# EAGLE schematic cbm2ram (EAGLE 7.7.0)
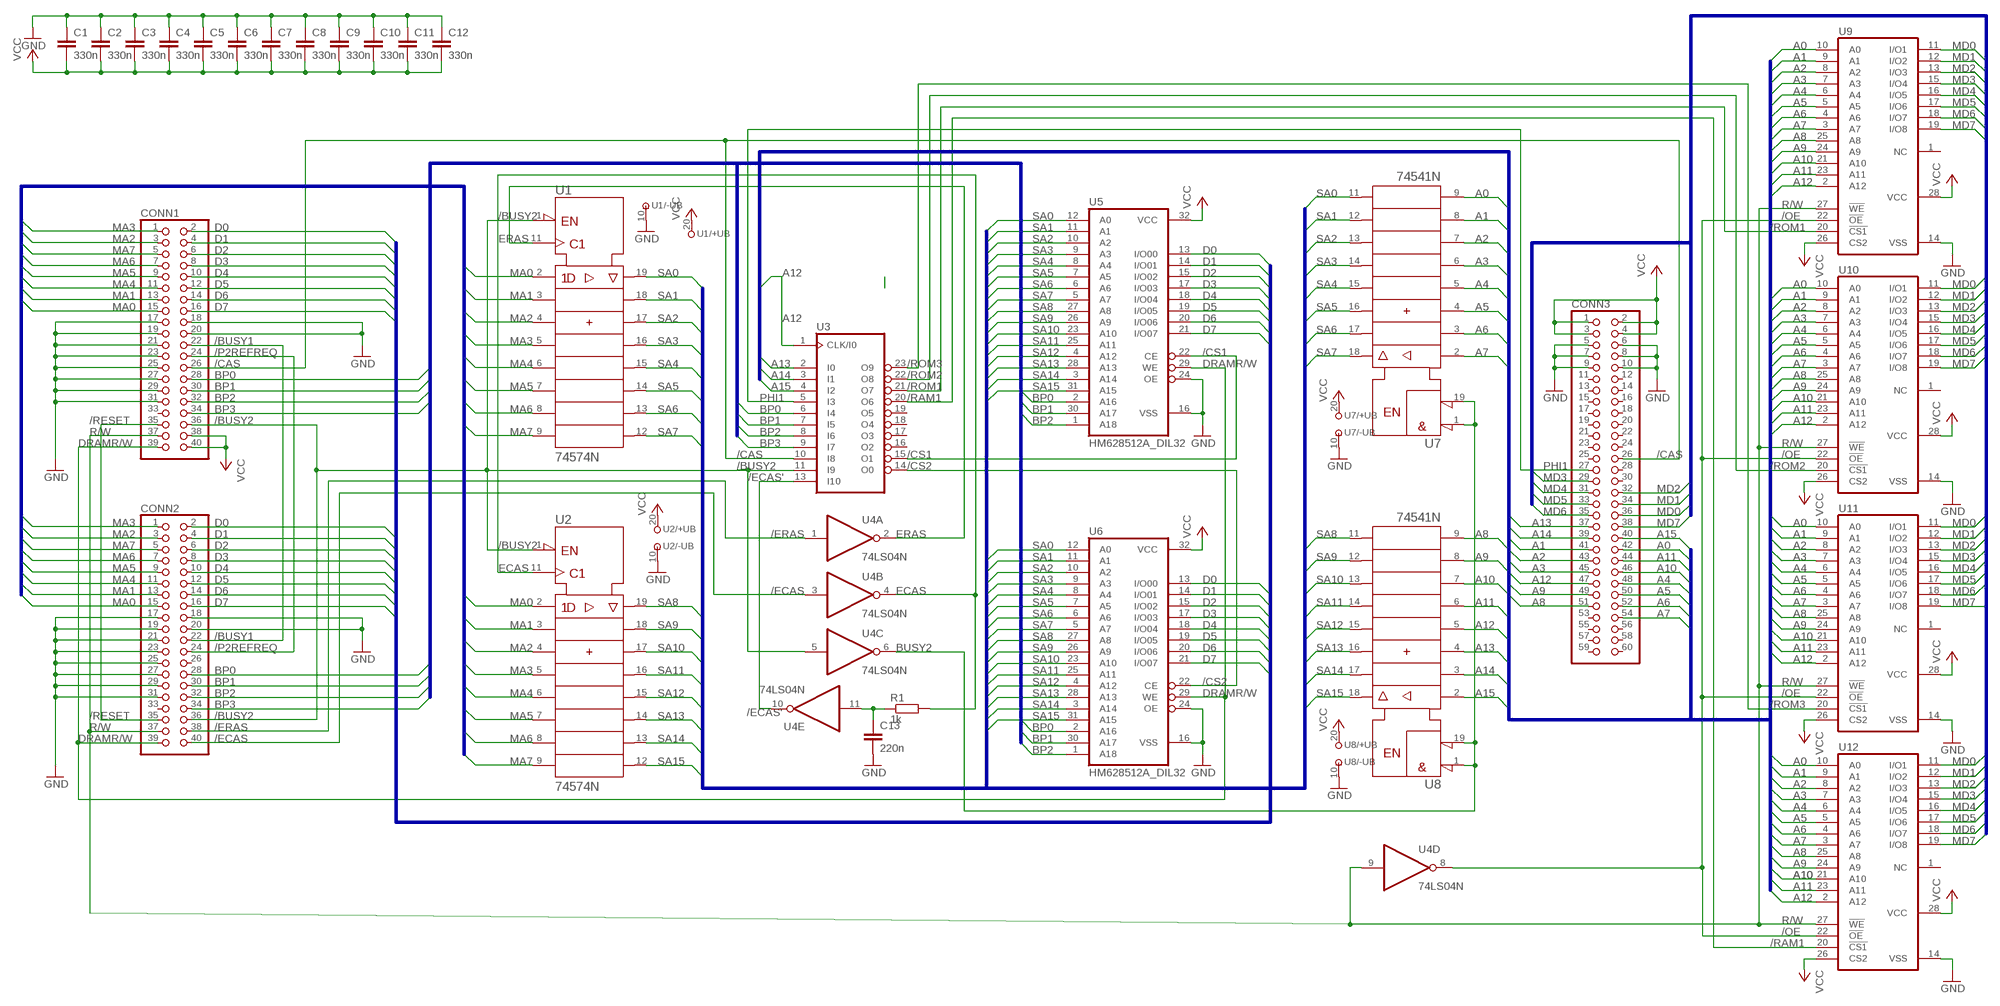
[diagram p0: schematic, sheet 1]

## Parts
C1  330n  C5/3  [C5B3]
C2  330n  C5/3  [C5B3]
C3  330n  C5/3  [C5B3]
C4  330n  C5/3  [C5B3]
C5  330n  C5/3  [C5B3]
C6  330n  C5/3  [C5B3]
C7  330n  C5/3  [C5B3]
C8  330n  C5/3  [C5B3]
C9  330n  C5/3  [C5B3]
C10  330n  C5/3  [C5B3]
C11  330n  C5/3  [C5B3]
C12  330n  C5/3  [C5B3]
C13  220n  C5/3  [C5B3]
CONN1  PINHD-2X20  [2X20]
CONN2  PINHD-2X20  [2X20]
CONN3  PINHD-2X30  [2X30]
R1  1k  R-EU_0207/10  [0207/10]
U1  74574N  [DIL20]
U2  74574N  [DIL20]
U3  22V10  [DIL24-3]
U4  74LS04N  [DIL14]
U5  HM628512A_DIL32  [DIL32]
U6  HM628512A_DIL32  [DIL32]
U7  74541N  [DIL20]
U8  74541N  [DIL20]
U9  6264A  [DIL28-6]
U10  6264A  [DIL28-6]
U11  6264A  [DIL28-6]
U12  6264A  [DIL28-6]

## Nets
/BUSY1: CONN1.22 CONN2.22
/BUSY2: CONN1.36 CONN2.36 U1.1(!OC) U2.1(!OC) U3.11(I9) U4.5(C:I)
/CAS: CONN1.26 CONN3.26 U3.10(I8)
/CS1: U3.15(O1) U5.22(CE)
/CS2: U3.14(O0) U6.22(CE)
/ECAS: CONN2.40 U4.3(B:I)
/ECAS': U3.13(I10) U4.10(E:O)
/ERAS: CONN2.38 U4.1(A:I)
/OE: U4.8(D:O) U9.22(!OE) U10.22(!OE) U11.22(!OE) U12.22(!OE)
/P2REFREQ: CONN1.24 CONN2.24
/RAM1: U3.20(O6) U12.20(!CS1)
/RESET: CONN1.35 CONN2.35
/ROM1: U3.21(O7) U9.20(!CS1)
/ROM2: U3.22(O8) U10.20(!CS1)
/ROM3: U3.23(O9) U11.20(!CS1)
A0: CONN3.42 U7.9(A8) U9.10(A0) U10.10(A0) U11.10(A0) U12.10(A0)
A1: CONN3.41 U7.8(A7) U9.9(A1) U10.9(A1) U11.9(A1) U12.9(A1)
A2: CONN3.43 U7.7(A6) U9.8(A2) U10.8(A2) U11.8(A2) U12.8(A2)
A3: CONN3.45 U7.6(A5) U9.7(A3) U10.7(A3) U11.7(A3) U12.7(A3)
A4: CONN3.48 U7.5(A4) U9.6(A4) U10.6(A4) U11.6(A4) U12.6(A4)
A5: CONN3.50 U7.4(A3) U9.5(A5) U10.5(A5) U11.5(A5) U12.5(A5)
A6: CONN3.52 U7.3(A2) U9.4(A6) U10.4(A6) U11.4(A6) U12.4(A6)
A7: CONN3.54 U7.2(A1) U9.3(A7) U10.3(A7) U11.3(A7) U12.3(A7)
A8: CONN3.51 U8.9(A8) U9.25(A8) U10.25(A8) U11.25(A8) U12.25(A8)
A9: CONN3.49 U8.8(A7) U9.24(A9) U10.24(A9) U11.24(A9) U12.24(A9)
A10: CONN3.46 U8.7(A6) U9.21(A10) U10.21(A10) U11.21(A10) U12.21(A10)
A11: CONN3.44 U8.6(A5) U9.23(A11) U10.23(A11) U11.23(A11) U12.23(A11)
A12: CONN3.47 U3.1(CLK/I0) U8.5(A4) U9.2(A12) U10.2(A12) U11.2(A12) U12.2(A12)
A13: CONN3.37 U3.2(I0) U8.4(A3)
A14: CONN3.39 U3.3(I1) U8.3(A2)
A15: CONN3.40 U3.4(I2) U8.2(A1)
BP0: CONN1.28 CONN2.28 U3.6(I4) U5.2(A16) U6.2(A16)
BP1: CONN1.30 CONN2.30 U3.7(I5) U5.30(A17) U6.30(A17)
BP2: CONN1.32 CONN2.32 U3.8(I6) U5.1(A18) U6.1(A18)
BP3: CONN1.34 CONN2.34 U3.9(I7)
BUSY2: U4.6(C:O) U7.1(!G1) U7.19(!G2) U8.1(!G1) U8.19(!G2)
D0: CONN1.2 CONN2.2 U5.13(I/O00) U6.13(I/O00)
D1: CONN1.4 CONN2.4 U5.14(I/O01) U6.14(I/O01)
D2: CONN1.6 CONN2.6 U5.15(I/O02) U6.15(I/O02)
D3: CONN1.8 CONN2.8 U5.17(I/O03) U6.17(I/O03)
D4: CONN1.10 CONN2.10 U5.18(I/O04) U6.18(I/O04)
D5: CONN1.12 CONN2.12 U5.19(I/O05) U6.19(I/O05)
D6: CONN1.14 CONN2.14 U5.20(I/O06) U6.20(I/O06)
D7: CONN1.16 CONN2.16 U5.21(I/O07) U6.21(I/O07)
DRAMR/W: CONN1.39 CONN2.39 U5.29(WE) U6.29(WE)
ECAS: R1.2 U2.11(CLK) U4.4(B:O)
ECAS': C13.1 R1.1 U4.11(E:I)
ERAS: U1.11(CLK) U4.2(A:O)
GND [power]: C1.1 C2.1 C3.1 C4.1 C5.1 C6.1 C7.1 C8.1 C9.1 C10.1 C11.1 C12.1 C13.2 CONN1.17 CONN1.18 CONN1.19 CONN1.20 CONN1.21 CONN1.23 CONN1.25 CONN1.27 CONN1.29 CONN1.31 CONN2.17 CONN2.18 CONN2.19 CONN2.20 CONN2.21 CONN2.23 CONN2.25 CONN2.27 CONN2.29 CONN2.31 CONN3.5 CONN3.6 CONN3.7 CONN3.8 CONN3.9 CONN3.10 U1.10(-UB) U2.10(-UB) U5.16(VSS) U5.24(OE) U6.16(VSS) U6.24(OE) U7.10(-UB) U8.10(-UB) U9.14(VSS) U10.14(VSS) U11.14(VSS) U12.14(VSS)
MA0: CONN1.15 CONN2.15 U1.2(1D) U2.2(1D)
MA1: CONN1.13 CONN2.13 U1.3(2D) U2.3(2D)
MA2: CONN1.3 CONN2.3 U1.4(3D) U2.4(3D)
MA3: CONN1.1 CONN2.1 U1.5(4D) U2.5(4D)
MA4: CONN1.11 CONN2.11 U1.6(5D) U2.6(5D)
MA5: CONN1.9 CONN2.9 U1.7(6D) U2.7(6D)
MA6: CONN1.7 CONN2.7 U1.8(7D) U2.8(7D)
MA7: CONN1.5 CONN2.5 U1.9(8D) U2.9(8D)
MD0: CONN3.36 U9.11(I/O1) U10.11(I/O1) U11.11(I/O1) U12.11(I/O1)
MD1: CONN3.34 U9.12(I/O2) U10.12(I/O2) U11.12(I/O2) U12.12(I/O2)
MD2: CONN3.32 U9.13(I/O3) U10.13(I/O3) U11.13(I/O3) U12.13(I/O3)
MD3: CONN3.29 U9.15(I/O4) U10.15(I/O4) U11.15(I/O4) U12.15(I/O4)
MD4: CONN3.31 U9.16(I/O5) U10.16(I/O5) U11.16(I/O5) U12.16(I/O5)
MD5: CONN3.33 U9.17(I/O6) U10.17(I/O6) U11.17(I/O6) U12.17(I/O6)
MD6: CONN3.35 U9.18(I/O7) U10.18(I/O7) U11.18(I/O7) U12.18(I/O7)
MD7: CONN3.38 U9.19(I/O8) U10.19(I/O8) U11.19(I/O8) U12.19(I/O8)
PHI1: CONN3.27 U3.5(I3)
R/W: CONN1.37 CONN2.37 U4.9(D:I) U9.27(!WE) U10.27(!WE) U11.27(!WE) U12.27(!WE)
SA0: U1.19(1Q) U5.12(A0) U6.12(A0) U7.11(Y8)
SA1: U1.18(2Q) U5.11(A1) U6.11(A1) U7.12(Y7)
SA2: U1.17(3Q) U5.10(A2) U6.10(A2) U7.13(Y6)
SA3: U1.16(4Q) U5.9(A3) U6.9(A3) U7.14(Y5)
SA4: U1.15(5Q) U5.8(A4) U6.8(A4) U7.15(Y4)
SA5: U1.14(6Q) U5.7(A5) U6.7(A5) U7.16(Y3)
SA6: U1.13(7Q) U5.6(A6) U6.6(A6) U7.17(Y2)
SA7: U1.12(8Q) U5.5(A7) U6.5(A7) U7.18(Y1)
SA8: U2.19(1Q) U5.27(A8) U6.27(A8) U8.11(Y8)
SA9: U2.18(2Q) U5.26(A9) U6.26(A9) U8.12(Y7)
SA10: U2.17(3Q) U5.23(A10) U6.23(A10) U8.13(Y6)
SA11: U2.16(4Q) U5.25(A11) U6.25(A11) U8.14(Y5)
SA12: U2.15(5Q) U5.4(A12) U6.4(A12) U8.15(Y4)
SA13: U2.14(6Q) U5.28(A13) U6.28(A13) U8.16(Y3)
SA14: U2.13(7Q) U5.3(A14) U6.3(A14) U8.17(Y2)
SA15: U2.12(8Q) U5.31(A15) U6.31(A15) U8.18(Y1)
VCC [power]: C1.2 C2.2 C3.2 C4.2 C5.2 C6.2 C7.2 C8.2 C9.2 C10.2 C11.2 C12.2 CONN1.38 CONN1.40 CONN3.1 CONN3.2 CONN3.3 CONN3.4 U1.20(+UB) U2.20(+UB) U5.32(VCC) U6.32(VCC) U7.20(+UB) U8.20(+UB) U9.26(CS2) U9.28(VCC) U10.26(CS2) U10.28(VCC) U11.26(CS2) U11.28(VCC) U12.26(CS2) U12.28(VCC)
Unconnected: CONN1.33 CONN2.26 CONN2.33 CONN3.11 CONN3.12 CONN3.13 CONN3.14 CONN3.15 CONN3.16 CONN3.17 CONN3.18 CONN3.19 CONN3.20 CONN3.21 CONN3.22 CONN3.23 CONN3.24 CONN3.25 CONN3.28 CONN3.30 CONN3.53 CONN3.55 CONN3.56 CONN3.57 CONN3.58 CONN3.59 CONN3.60 U3.16(O2) U3.17(O3) U3.18(O4) U3.19(O5) U4.12(F:O) U4.13(F:I) U9.1(NC) U10.1(NC) U11.1(NC) U12.1(NC)

## Buses
D[0..7]
MA[0..7]
BP[0..3]
SA[0..15]
A[0..15]
MD[0..7]

## Power pins joined to a net without a drawn wire
GND: U3.12(GND) U4.7(P:GND)
VCC: U3.24(VCC) U4.14(P:VCC)

## Library data of the parts
C1-C13 = capacitor-wima:C: CAPACITOR naming: grid - package width
CONN1 CONN2 = pinhead:PINHD-2X20: PIN HEADER
CONN3 = pinhead:PINHD-2X30: PIN HEADER
R1 = resistor:R-EU_: RESISTOR, European symbol
U1 U2 = 74ttl-din:74*574: 8-bit D type FLIP FLOP bus driver
U3 = pal:22V10: PAL; MPN: GAL22V10D-7LPN; OC_FARNELL: 1571925; OC_NEWARK: 97M0480
U4 = 74xx-eu:74*04: Hex INVERTER
U5 U6 = hitachi_sram_hm628512a-series_rev1:HM628512A_DIL32: 4M SRAM 512kword x 8bit
U7 U8 = 74ttl-din:74*541: Octal BUFFER and LINE DRIVER, 3-state
U9-U12 = memory-hitachi:6264A: MEMORY; OC_FARNELL: 283605; OC_NEWARK: unknown

## Net classes
0 default: width 0.203 mm, clearance 0.203 mm
1 power: width 0.635 mm, clearance 0.254 mm to class 0, clearance 0.254 mm